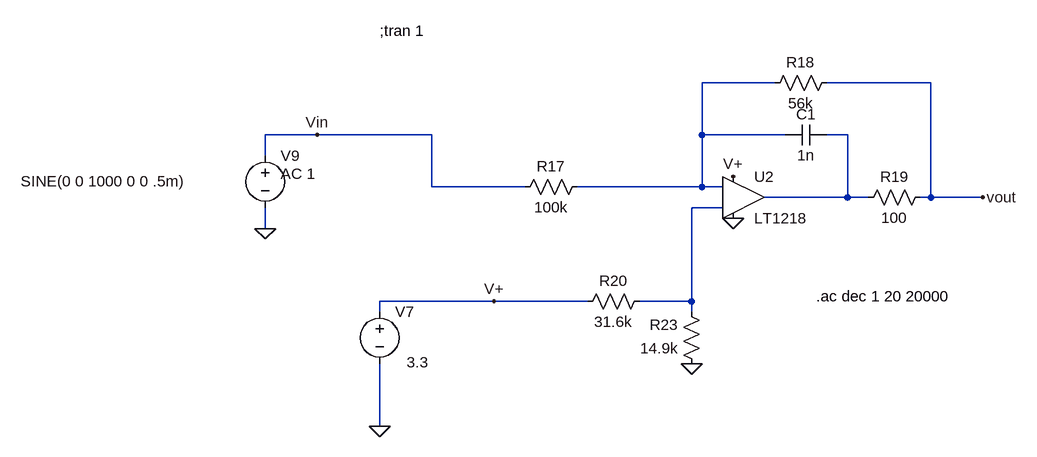
[diagram p0: schematic ADC_matching_2.asc]
ADC_matching_2.asc, the LTspice schematic file:
Version 4
SHEET 1 3480 916
WIRE 848 -48 736 -48
WIRE 1088 -48 928 -48
WIRE 144 32 64 32
WIRE 320 32 144 32
WIRE 736 32 736 -48
WIRE 864 32 736 32
WIRE 960 32 928 32
WIRE 64 64 64 32
WIRE 320 112 320 32
WIRE 464 112 320 112
WIRE 736 112 736 32
WIRE 736 112 544 112
WIRE 768 112 736 112
WIRE 960 128 960 32
WIRE 960 128 832 128
WIRE 992 128 960 128
WIRE 1088 128 1088 -48
WIRE 1088 128 1072 128
WIRE 1168 128 1088 128
WIRE 768 144 720 144
WIRE 64 176 64 144
WIRE 416 288 240 288
WIRE 560 288 416 288
WIRE 720 288 720 144
WIRE 720 288 640 288
WIRE 240 304 240 288
WIRE 720 304 720 288
WIRE 240 480 240 384
FLAG 64 176 0
FLAG 144 32 Vin
FLAG 1168 128 vout
FLAG 720 384 0
FLAG 240 480 0
FLAG 416 288 V+
FLAG 784 96 V+
FLAG 784 160 0
SYMBOL voltage 240 288 R0
WINDOW 3 42 94 Left 2
WINDOW 123 0 0 Left 0
WINDOW 39 0 0 Left 0
SYMATTR Value 3.3
SYMATTR InstName V7
SYMBOL voltage 64 48 R0
WINDOW 3 -376 55 Left 2
WINDOW 123 24 44 Left 2
WINDOW 39 0 0 Left 0
SYMATTR Value SINE(0 0 1000 0 0 .5m)
SYMATTR Value2 AC 1
SYMATTR InstName V9
SYMBOL res 560 96 R90
WINDOW 0 0 56 VBottom 2
WINDOW 3 32 56 VTop 2
SYMATTR InstName R17
SYMATTR Value 100k
SYMBOL res 944 -64 R90
WINDOW 0 0 56 VBottom 2
WINDOW 3 32 56 VTop 2
SYMATTR InstName R18
SYMATTR Value 56k
SYMBOL res 1088 112 R90
WINDOW 0 0 56 VBottom 2
WINDOW 3 32 56 VTop 2
SYMATTR InstName R19
SYMATTR Value 100
SYMBOL res 656 272 R90
WINDOW 0 0 56 VBottom 2
WINDOW 3 32 56 VTop 2
SYMATTR InstName R20
SYMATTR Value 31.6k
SYMBOL res 736 400 R180
WINDOW 0 36 76 Left 2
WINDOW 3 36 40 Left 2
SYMATTR InstName R23
SYMATTR Value 14.9k
SYMBOL cap 928 16 R90
WINDOW 0 0 32 VBottom 2
WINDOW 3 32 32 VTop 2
SYMATTR InstName C1
SYMATTR Value 1n
SYMBOL Opamps\\LT1218 800 128 R0
SYMATTR InstName U2
TEXT 912 280 Left 2 !.ac dec 1 20 20000
TEXT 240 -128 Left 2 !;tran 1

The netlist it stands for:
* ADC_matching_2.asc
V7 V+ 0 3.3
V9 Vin 0 SINE(0 0 1000 0 0 .5m) AC 1
R17 N001 Vin 100k
R18 vout N001 56k
R19 vout N002 100
R20 N003 V+ 31.6k
R23 0 N003 14.9k
C1 N002 N001 1n
XU2 N003 N001 V+ 0 N002 NC_01 LT1218
.ac dec 1 20 20000
;tran 1
.lib LTC.lib
.backanno
.end